# Altium project PCB_Fungnator.PrjPcb
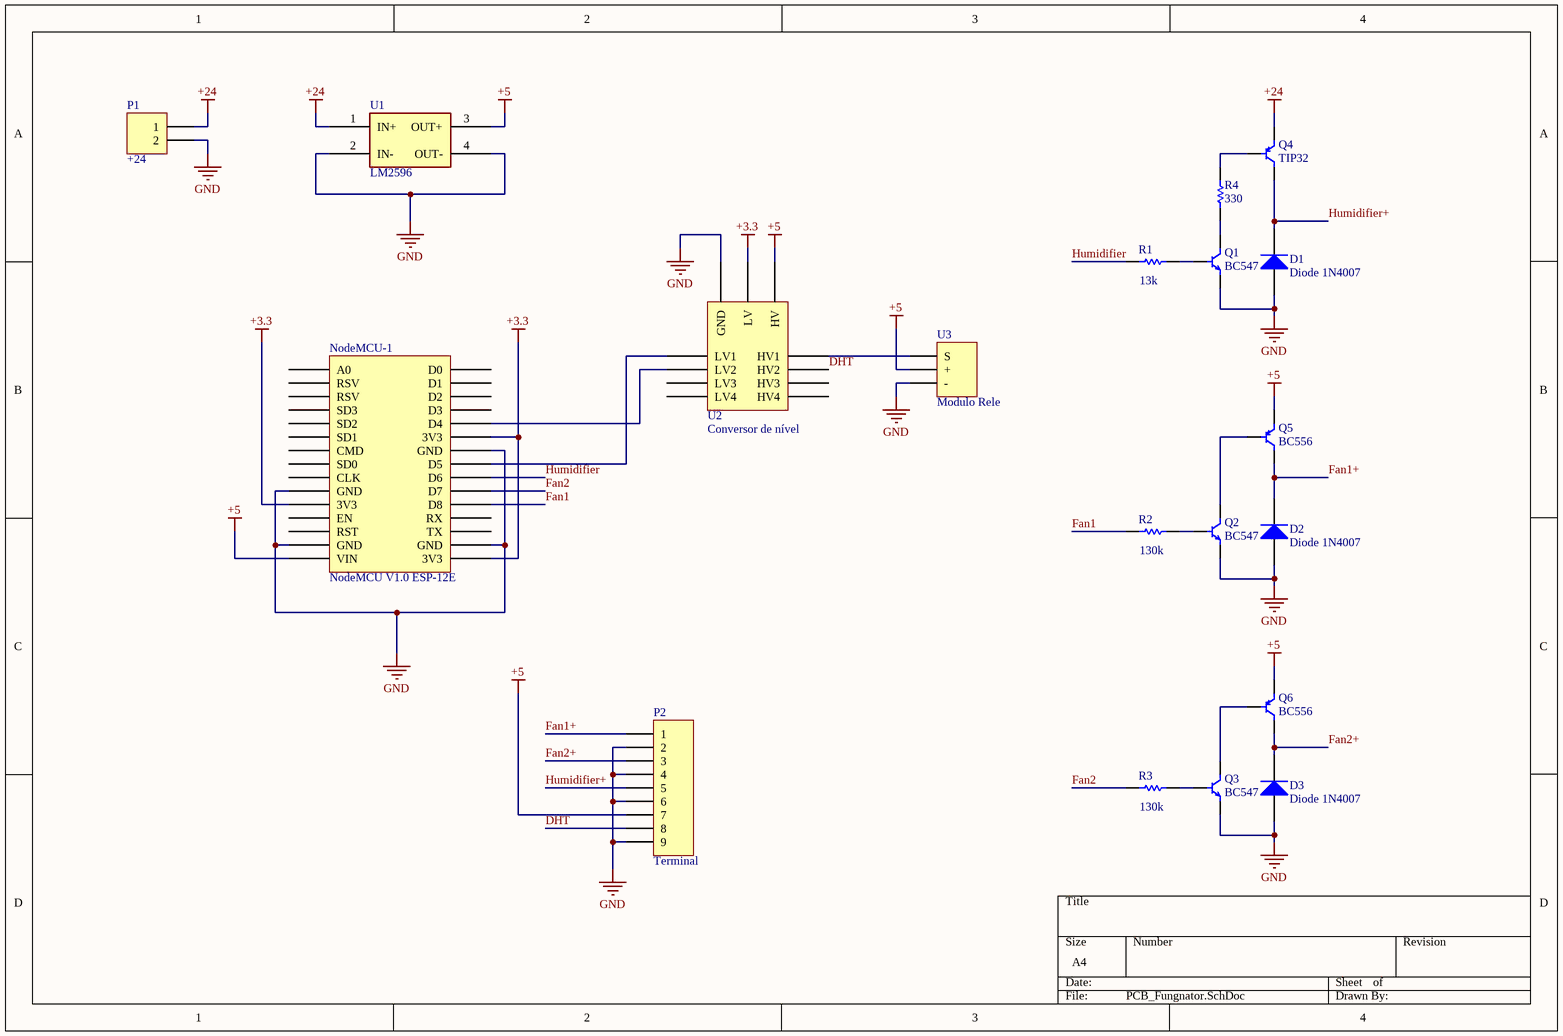
[diagram p0: PCB_Fungnator.SchDoc]
1 sheet, 19 parts. Net scope: global (net labels, ports and power ports of the same name join across sheets).
Board file: PCB_Fungnator.PcbDoc

## Sheet PCB_Fungnator.SchDoc
size A4

### Parts
D1  Diode 1N4007  [DO-41]
D2  Diode 1N4007  [DO-41]
D3  Diode 1N4007  [DO-41]
NodeMCU-1  NodeMCU V1.0 ESP-12E  [NodeMCU V1.0 ESP-12E]
P1  +24  [KRE_2]
P2  Terminal  [KRE_9]
Q1  BC547  [TO-92/CBE]
Q2  BC547  [TO-92/CBE]
Q3  BC547  [TO-92/CBE]
Q4  TIP32  [TO-220/BCE]
Q5  BC556  [TO-92/CBE]
Q6  BC556  [TO-92/CBE]
R1  value 13k  [AXIAL-0.3]  (hidden comment: Res1)
R2  value 130k  [AXIAL-0.3]  (hidden comment: Res1)
R3  value 130k  [AXIAL-0.3]  (hidden comment: Res1)
R4  value 330  [AXIAL-0.3]  (hidden comment: Res1)
U1  LM2596  [LM2596]
U2  Conversor de nível  [Conversor_Nivel]
U3  Modulo Rele  [MODULO_RELE]

### Nets
+3.3: NodeMCU-1.3V3 U2.3(LV)
+5: NodeMCU-1.VIN P2.7 Q5.E Q6.E U1.3(OUT+) U2.9(HV) U3.2(+)
+24: P1.1 Q4.E U1.1(IN+)
GND: D1.1(A) D2.1(A) D3.1(A) NodeMCU-1.GND P1.2 P2.2 P2.4 P2.6 P2.9 Q1.E Q2.E Q3.E U1.2(IN-) U1.4(OUT-) U2.4(GND) U3.3(-)
DHT: P2.8 U2.8(HV2)
Fan1: NodeMCU-1.D8 R2.1
Fan1+: D2.2(K) P2.1 Q5.C
Fan2: NodeMCU-1.D7 R3.1
Fan2+: D3.2(K) P2.3 Q6.C
Humidifier: NodeMCU-1.D6 R1.1
Humidifier+: D1.2(K) P2.5 Q4.C
NetNodeMCU-1_D4: NodeMCU-1.D4 U2.2(LV2)
NetNodeMCU-1_D5: NodeMCU-1.D5 U2.1(LV1)
NetQ1_B: Q1.B R1.2
NetQ1_C: Q1.C R4.1
NetQ2_B: Q2.B R2.2
NetQ2_C: Q2.C Q5.B
NetQ3_B: Q3.B R3.2
NetQ3_C: Q3.C Q6.B
NetQ4_B: Q4.B R4.2
NetU2_7: U2.7(HV1) U3.1(S)

Not connected (* = marked no-connect by the designer): NodeMCU-1 A0 CLK CMD D0 D1 D2 D3 EN RST RSV RX SD0 SD1 SD2 SD3 TX; U2 5(LV3) 6(LV4) 11(HV3) 12(HV4)

### Library data of the parts
D1-D3 = Diode 1N4007: 1 Amp General Purpose Rectifier; Published: 8-Jun-2000; LatestRevisionDate: 17-Jul-2002; LatestRevisionNote: Re-released for DXP Platform.; DatasheetVersion: 1998; PackageVersion: Aug-1999; PackageReference: DO-41; Publisher: Altium Limited; PackageDescription: Diode, Axial; Body 5.2 x 2.7 mm (LxDia. max), Lead Dia. 0.86 mm (max); Code_JEDEC: DO-204-AL; ComponentLink1Description: Manufacturer Link; ComponentLink1URL: http://www.fairchildsemi.com/; ComponentLink2Description: Datasheet; ComponentLink2URL: http://www.fairchildsemi.com/ds/1N%2F1N4001.pdf
NodeMCU-1 = NodeMCU V1.0 ESP-12E: NodeMCU V1.0 ESP8266 (ESP-12E)
P1 = KRE_2: Terminal Block 1x2
P2 = KRE_9: Terminal Block 1x9
Q1-Q3 = BC547: NPN Epitaxial Silicon Transistor; Complementary Part: BC557; Collector-Base Voltage (Vcb): 50 V; Collector-Emitter Voltage (Vce): 45 V; Emitter-Base Voltage (Veb): 6 V; Collector Current (Ic): 100 mA; Total Power Dissipation (Ptot): 500 mW; DC Current Gain Min (hfe): 110; DC Current Gain Max (hfe): 800; Transition Frequency (fT): 300 MHz
Q4 = TIP32: PNP Epitaxial Silicon Transistor; Complementary Part: TIP31; Collector-Base Voltage (Vcb): -40 V; Emitter-Base Voltage (Veb): -5 V; Collector Current (Ic): -3 A; Collector Peak Current (Icp): -5 A; Total Power Dissipation (Ptot): 40 W; DC Current Gain Min (hfe): 10; DC Current Gain Max (hfe): 50; Transition Frequency (fT): 3 MHz; Collector-Emitter Voltage (Vce): -40 V; Base Peak Current (Ibp): -3 A
Q5 Q6 = BC556: PNP Epitaxial Silicon Transistor; Complementary Part: BC546; Collector-Base Voltage (Vcb): -80 V; Collector-Emitter Voltage (Vce): -65 V; Emitter-Base Voltage (Veb): -5 V; Collector Current (Ic): -100 mA; Total Power Dissipation (Ptot): 500 mW; DC Current Gain Min (hfe): 110; DC Current Gain Max (hfe): 800; Transition Frequency (fT): 150 MHz
R1-R4 = Res1: Resistor; Published: 8-Jun-2000; LatestRevisionDate: 17-Jul-2002; LatestRevisionNote: Re-released for DXP Platform.; PackageReference: AXIAL-0.3; Publisher: Altium Limited; PackageDescription: Axial Device, Thru-Hole; 2 Leads; 0.3 in Pin Spacing